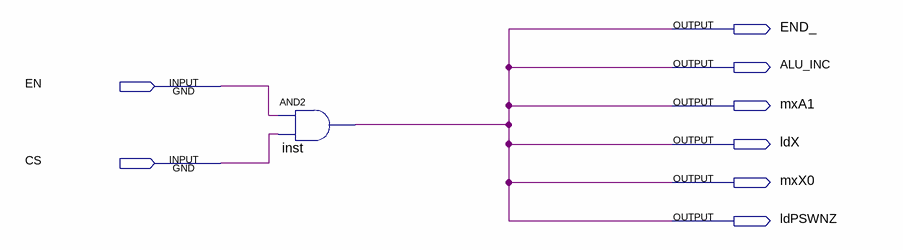
[diagram p0: schematic sheet]
// Quartus schematic INX.bdf as structural Verilog: 1 symbols, 8 pins
module INX (
  input  EN,
  input  CS,
  output END_,
  output ALU_INC,
  output mxA1,
  output ldX,
  output mxX0,
  output ldPSWNZ
);

  and inst (ALU_INC, EN, CS);

  assign END_ = ALU_INC;
  assign ldPSWNZ = ALU_INC;
  assign ldX = ALU_INC;
  assign mxA1 = ALU_INC;
  assign mxX0 = ALU_INC;
endmodule
